# Altium schematic sheet Cover page.SchDoc
size A4; DocumentNumber: 1; SheetNumber: 1; SheetTotal: 31
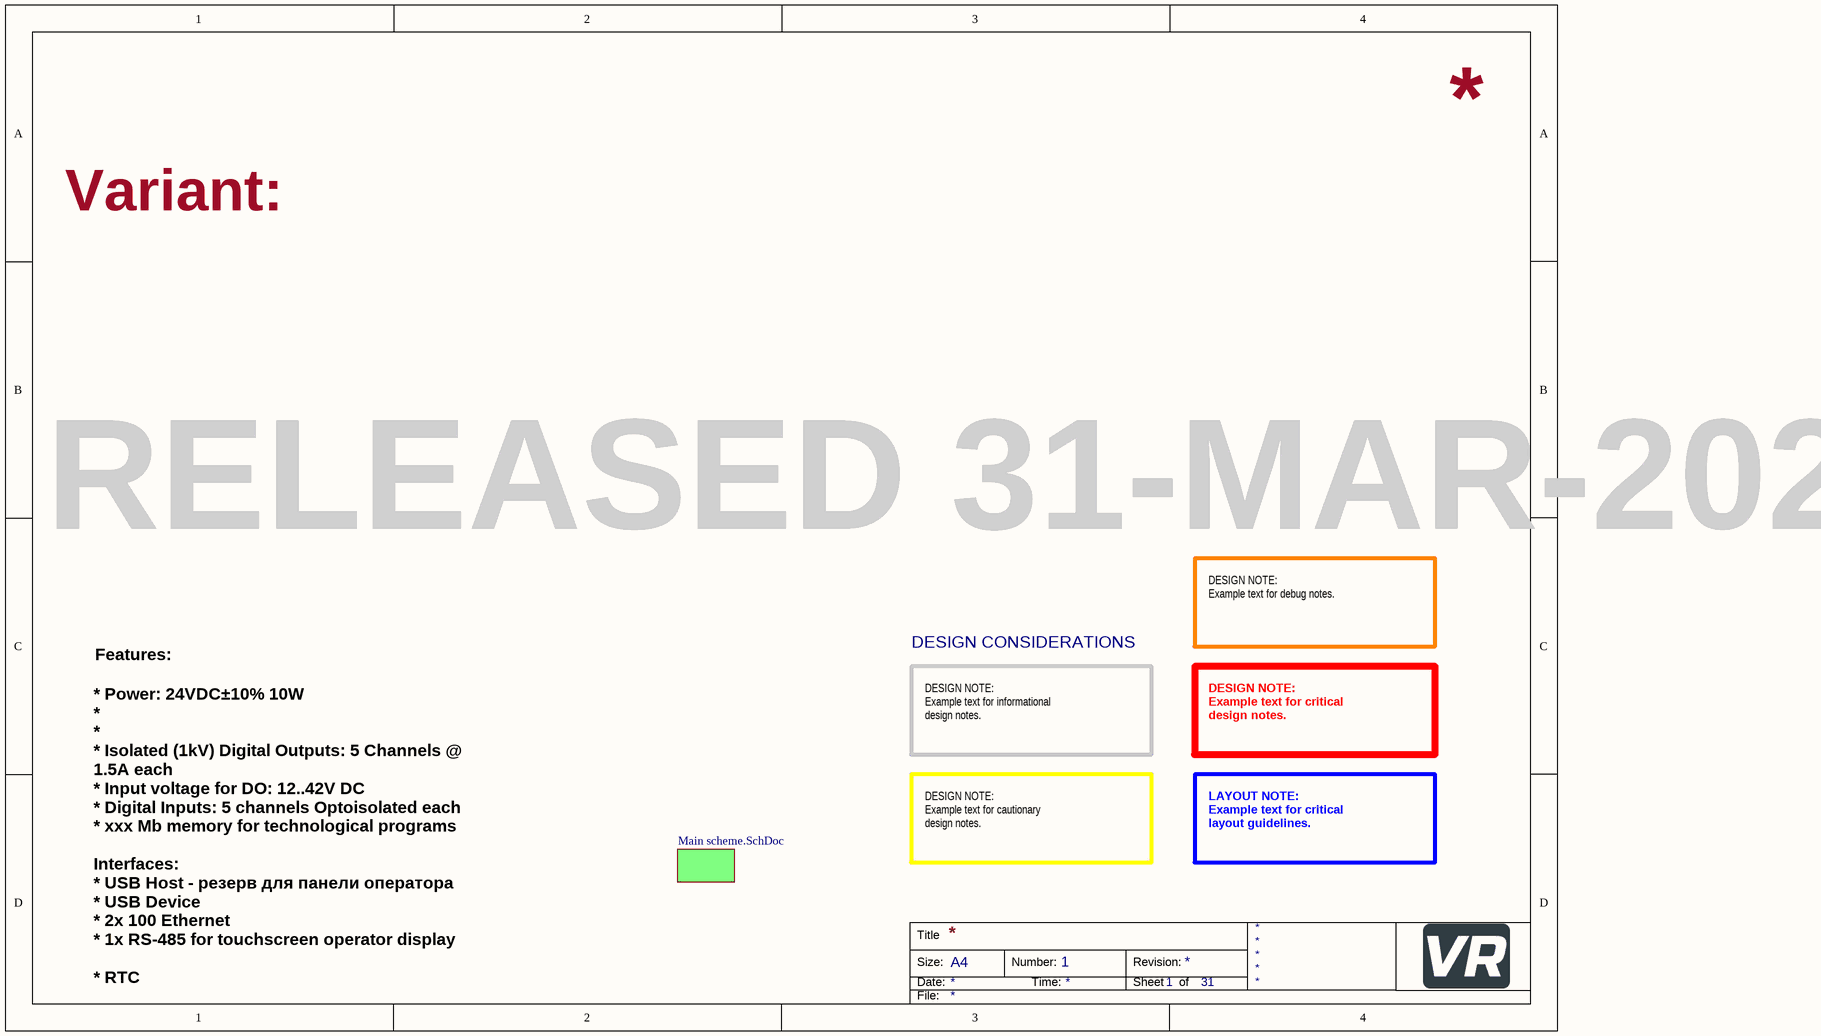
[diagram p0: Cover page.SchDoc]

## Sub-sheets
Designator = Main scheme.SchDoc: no entries

## Notes on the sheet
- Variant:
- RELEASED 31-MAR-2023
- DESIGN CONSIDERATIONS
- DESIGN NOTE:
  Example text for debug notes.
- Features:
- DESIGN NOTE:
  Example text for informational
  design notes.
- DESIGN NOTE:
  Example text for critical
  design notes.
- DESIGN NOTE:
  Example text for cautionary
  design notes.
- LAYOUT NOTE:
  Example text for critical
  layout guidelines.
- * Power: 24VDC±10% 10W
  *
  *
  * Isolated (1kV) Digital Outputs: 5 Channels @ 1.5A each
  * Input voltage for DO: 12..42V DC
  * Digital Inputs: 5 channels Optoisolated each
  * xxx Mb memory for technological programs
  Interfaces:
  * USB Host - резерв для панели оператора
  * USB Device
  * 2x 100 Ethernet
  * 1x RS-485 for touchscreen operator display
  * RTC
  * Beeper
- Title
- Size:
- Date:
- A4
- Number:
- Time:
- Revision:
- Sheet
- of
- File: